# Altium schematic sheet RTD Schematic Ian First revision.SchDoc
size A3; SheetNumber: 1; SheetTotal: 1
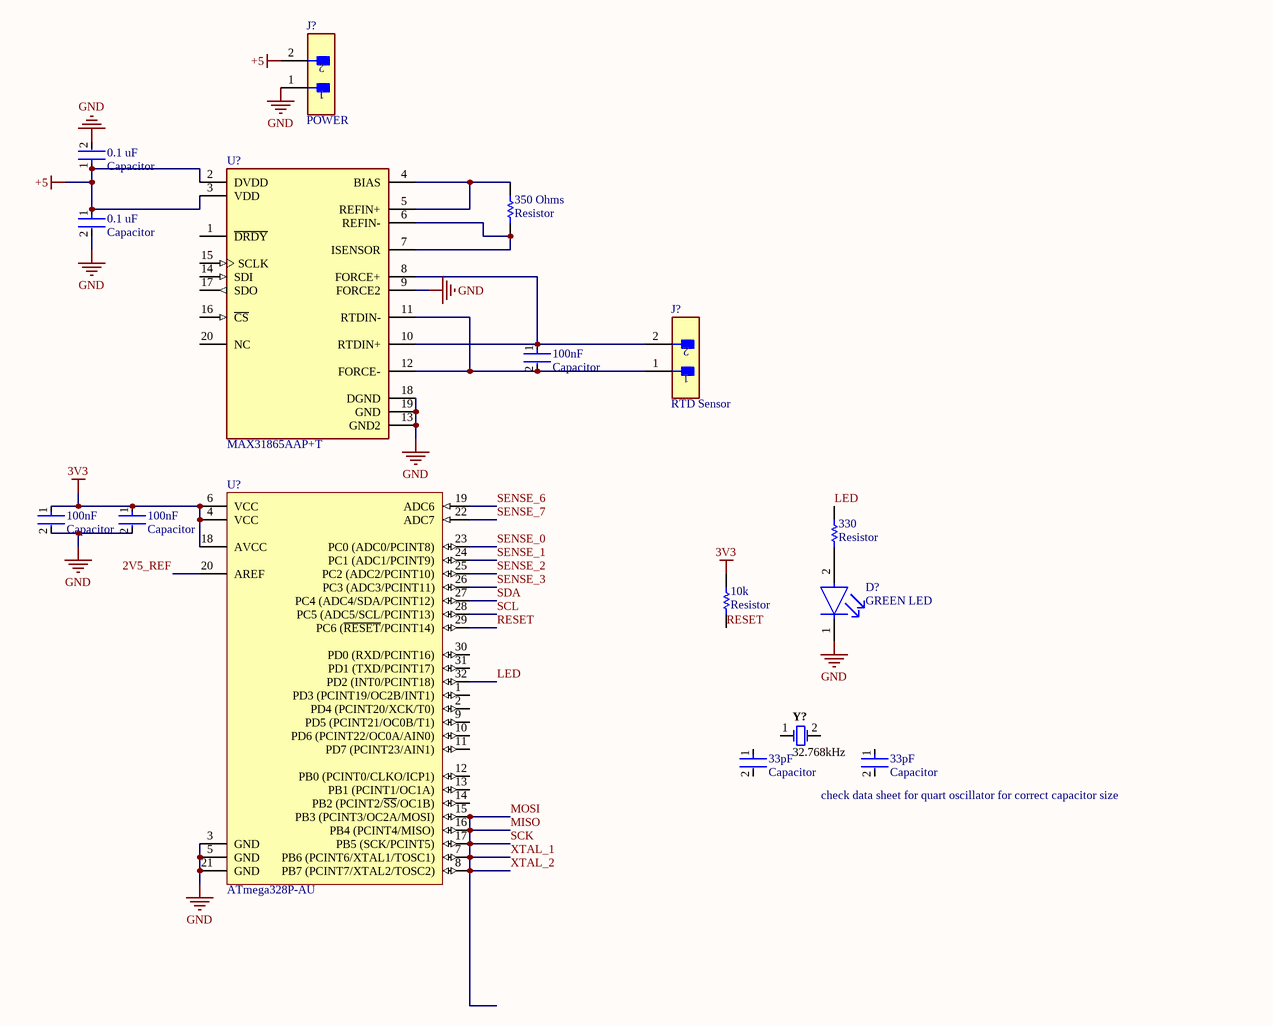
[diagram p0: RTD Schematic Ian First revision.SchDoc]

## Parts
(Parts that share a designator on the sheet are numbered #1, #2 ... from top to bottom, then left to right.)
0.1_uF#1  Capacitor  [FP-C0402-BB-MFG]
0.1_uF#2  Capacitor  [FP-C0402-BB-MFG]
10k  Resistor  [RESC1609X50X30NL8T20]
33pF#1  Capacitor  [FP-C0402-BB-MFG]
33pF#2  Capacitor  [FP-C0402-BB-MFG]
100nF#1  Capacitor  [FP-C0402-BB-MFG]
100nF#2  Capacitor  [FP-C0402-BB-MFG]
100nF#3  Capacitor  [FP-C0402-BB-MFG]
330  Resistor  [RESC1609X50X30NL8T20]
350_Ohms  Resistor  [RESC1609X50X30NL8T20]
D?  GREEN LED  [FP-597-3301-507F-MFG]
J?#1  POWER  [FP-B2B-XH-A_LF_SN-MFG]
J?#2  RTD Sensor  [FP-B2B-XH-A_LF_SN-MFG]
U?#1  MAX31865AAP+T  [FP-A20-1-MFG]
U?#2  ATmega328P-AU  [32A_M]
Y?  32.768kHz  [TXC-9HT10_V]

## Nets
3V3: 10k.2 100nF#2.1 100nF#3.1 U?#2.4(VCC) U?#2.6(VCC) U?#2.18(AVCC)
+5: 0.1_uF#1.1 0.1_uF#2.1 J?#1.2 U?#1.2(DVDD) U?#1.3(VDD)
GND: 0.1_uF#1.2 0.1_uF#2.2 100nF#2.2 100nF#3.2 D?.1(C) J?#1.1 U?#1.9(FORCE2) U?#1.13(GND2) U?#1.18(DGND) U?#1.19(GND) U?#2.3(GND) U?#2.5(GND) U?#2.21(GND)
2V5_REF: U?#2.20(AREF)
LED: 330.1 U?#2.32(PD2_(INT0/PCINT18))
MISO: U?#2.7(PB6_(PCINT6/XTAL1/TOSC1)) U?#2.8(PB7_(PCINT7/XTAL2/TOSC2)) U?#2.15(PB3_(PCINT3/OC2A/MOSI)) U?#2.16(PB4_(PCINT4/MISO)) U?#2.17(PB5_(SCK/PCINT5))  [also labelled MOSI, SCK, XTAL_1, XTAL_2]
RESET: 10k.1 U?#2.29(PC6_(~{RESET}/PCINT14))
SCL: U?#2.28(PC5_(ADC5/SCL/PCINT13))
SDA: U?#2.27(PC4_(ADC4/SDA/PCINT12))
SENSE_0: U?#2.23(PC0_(ADC0/PCINT8))
SENSE_1: U?#2.24(PC1_(ADC1/PCINT9))
SENSE_2: U?#2.25(PC2_(ADC2/PCINT10))
SENSE_3: U?#2.26(PC3_(ADC3/PCINT11))
SENSE_6: U?#2.19(ADC6)
SENSE_7: U?#2.22(ADC7)
Net100nF#1_1: 100nF#1.1 J?#2.2 U?#1.8(FORCE+) U?#1.10(RTDIN+)
Net100nF#1_2: 100nF#1.2 J?#2.1 U?#1.11(RTDIN-) U?#1.12(FORCE-)
Net330_2: 330.2 D?.2(A)
Net350_Ohms_1: 350_Ohms.1 U?#1.6(REFIN-) U?#1.7(ISENSOR)
Net350_Ohms_2: 350_Ohms.2 U?#1.4(BIAS) U?#1.5(REFIN+)

Not connected (* = marked no-connect by the designer): 33pF#1 1 2; 33pF#2 1 2; U?#1 1(~{DRDY}) 14(SDI) 15(SCLK) 16(~{CS}) 17(SDO) 20(NC); U?#2 1(PD3_(PCINT19/OC2B/INT1)) 2(PD4_(PCINT20/XCK/T0)) 9(PD5_(PCINT21/OC0B/T1)) 10(PD6_(PCINT22/OC0A/AIN0)) 11(PD7_(PCINT23/AIN1)) 12(PB0_(PCINT0/CLKO/ICP1)) 13(PB1_(PCINT1/OC1A)) 14(PB2_(PCINT2/~{SS}/OC1B)) 30(PD0_(RXD/PCINT16)) 31(PD1_(TXD/PCINT17)); Y? 1 2

## Notes on the sheet
- (near 33pF#2) check data sheet for quart oscillator for correct capacitor size

## Library data of the parts
0.1_uF#1 0.1_uF#2 33pF#1 33pF#2 100nF#1-100nF#3 = CMP-2008-02046-2: CAP CER 0.1UF 10V X5R 0402; Manufacturer: Kemet; Manufacturer Part Number: C0402C104K8PACTU; Capacitance: 0.10 μF; Temperature Coefficient: 15%; Tolerance: 0.1; Value: 0.10 μF; Material: Ceramic; Package: C0402-BB; Temperature: -55°C to +125°C; ComponentLink2Description: Datasheet; Temperature Characteristic: X5R; Device Class L1: Passive Components; Height: 0.55mm; Lead Free: Yes; ComponentLink2URL: https://content.kemet.com/datasheets/KEM_C1002_X7R_SMD.pdf; Device Class L2: Capacitors; Temperature Range Low: -55°C; Temperature Range High: +125°C; RoHS: TRUE; Octopart: https://octopart.com/c0402c104k8pactu-kemet-140039; Automotive: No; Mouser Description: Capacitor 100 nF 10 VDC 0402; Category: Cap; Voltage Rating: 10 V; Digikey Description: CAP CER 0.1UF 10V X5R 0402; Ipc Land Pattern Name: CAPC10050X50; Device Class L3: Ceramic Capacitors
10k 330 350_Ohms = CMP-2000-03816-5: Chip Resistor, 0 Ohm, Jumper, 100 mW, -55 to 155 degC, 0603 (1608 Metric), RoHS, Tape and Reel; Manufacturer: Vishay Semiconductor; Voltage Rating: 75 V; Package Quantity: 5000; DatasheetVersion: 06/2012; Min Operating Temperature: -55 degC; ComponentLink1URL: http://www.vishay.com/; Mounting Technology: Surface Mount; Height: 0.45 mm; ComponentLink1Description: Manufacturer URL; REACH SVHC: Unknown; PackageReference: 0603; Packaging: Tape and Reel; Max Operating Temperature: 155 degC; Mount: Surface Mount; ComponentLink2Description: Datasheet; PackageDescription: 2-Pin Surface Mount Device, Body 1.575 x 0.85 mm; Length: 1.55 mm; ComponentLink2URL: http://www.vishay.com/docs/20035/dcrcwe3.pdf; Pins: 2; RoHSCompliant: true
D? = CMP-15384-000001-1: LED GREEN CLEAR 1208 SMD; Manufacturer: Dialight; Manufacturer Part Number: 597-3301-507F; Wavelength: 573nm; Luminous Intensity: 25mcd; Led Orientation: Top View; Power Dissipation: 70mW; Forward Current: 20mA; Viewing Angle: 110°; Forward Voltage: 2.2V; Peak Emmision Wavelength: 570nm; RoHS: TRUE; Temperature Range High: +85°C; Octopart: https://octopart.com/597-3301-507f-dialight-117926; Device Class L3: unset; Device Class L1: Optoelectronics; Automotive: No; Lead Free: Yes; Height: 1.5mm; ComponentLink2Description: Datasheet; Temperature Range Low: -30°C; Mouser Description: Standard LEDs - SMD Green 563nm 16mcd 2.2V 104 deg; Device Class L2: LEDs; Temperature: -30°C to +85°C; Package: 597-3301-507F; ComponentLink2URL: http://www.dialightsignalsandcomponents.com/Assets/Drawings/2D_Drawings_DrawingDetailedSpec/C17290.pdf; Category: Diode; Colour: Green; Digikey Description: LED GREEN CLEAR 1208 SMD
J?#1 J?#2 = CMP-2000-05888-3: CONN HEADER VERT 2POS 2.5MM; Current Rating: 3A; Voltage Rating: 250V; Number of Contacts: 2; Contact Resistance: 20mR; Wire/Cable Gauge: 22AWG; Insulation Resistance: 1GR; Connector Type: Male Pin; Packaging: Bulk; Contact Material: Brass; Lead Free: Lead Free; Orientation: Straight; Contact Plating: Tin; Max Current Rating: 3A; Termination: Solder; Fastening Type: Detent; Depth: 5.75mm; Housing Material: Polyamide; REACH SVHC: No SVHC; Series: XH; Voltage Rating (AC): 250V; Number of Positions: 2; Color: Natural; Contact Type: Male Pin; Max Voltage Rating (DC): 250V; Pitch: 2.5mm; Lead Pitch: 2.5mm; Mount: Through Hole; Max Operating Temperature: 85°C; Length: 7.4mm; Max Voltage Rating (AC): 250V; Min Operating Temperature: -25°C; Number of Rows: 1; Housing Color: White
U?#1 = CMP-05687-000005-1: IC RTD TO DIGITAL CONVERT 20SSOP; Output Type: SPI; Min Operating Temperature: -40°C; Packaging: Tape and Reel; Mount: Surface Mount; Case/Package: SSOP; Max Operating Temperature: 125°C
U?#2 = CMP-0095-00269-2: 8-bit AVR Microcontroller, 32KB Flash, 1KB EEPROM, 2KB SRAM, 32-pin TQFP, Industrial Grade (-40°C to 85°C); PackageDescription: 32-Lead, 7x7x1.0 mm Body, 0.8mm Lead Pitch, Thin Profile Plastic Quad Flat Package (TQFP); DatasheetVersion: revD, May-2011; RevisionNote: DatasheetVersion & PackageVersion updated. URLs added.; ComponentLink1URL: http://www.atmel.com/; ComponentLink2Description: ATmega48A/48PA/88A/88PA/168A/168PA/328/328P Datasheet; Code_JEDEC: MS-026-ABA; ComponentLink1Description: Manufacturer URL; PackageReference: 32A; ComponentLink3Description: ATmega48A/48PA/88A/88PA/168A/168PA/328/328P Summary; ComponentLink2URL: http://www.atmel.com/dyn/resources/prod_documents/doc8271.pdf; PackageVersion: revC, Oct-2010; ComponentLink3URL: http://www.atmel.com/dyn/resources/prod_documents/8271S.pdf
Y? = CMP-1774-00002-2: Tuning Fork, 32.768 KHz, -40 to 85 degC, 2-Pin SMD, RoHS, Tape and Reel; Tolerance: 1%; Resistance: 220 kohm; Case\Package: 0603; Voltage Rating: 75 V; Power Rating: 100 mW; Package Quantity: 5000; ComponentLink1URL: http://www.txccrystal.com/images/pdf/9ht10.pdf; DatasheetVersion: Jun-11; Pins: 2; Mount: Surface Mount; Width: 0.8 mm; Height: 0.45 mm; PackageReference: 9HT10; Length: 1.6 mm; PackageDescription: 2-Pin Surface Mount Device, Body 3.2 x 1.5 mm; Radiation Hardening: No; ComponentLink1Description: Datasheet; RoHSCompliant: true; Case Code (Metric): 1608; REACH SVHC: Yes; Min Operating Temperature: -55 degC; Packaging: Tape and Reel; Max Operating Temperature: 155 degC; Case Code (Imperial): 0603